# EAGLE schematic Voltage2 (EAGLE 9.1.3)
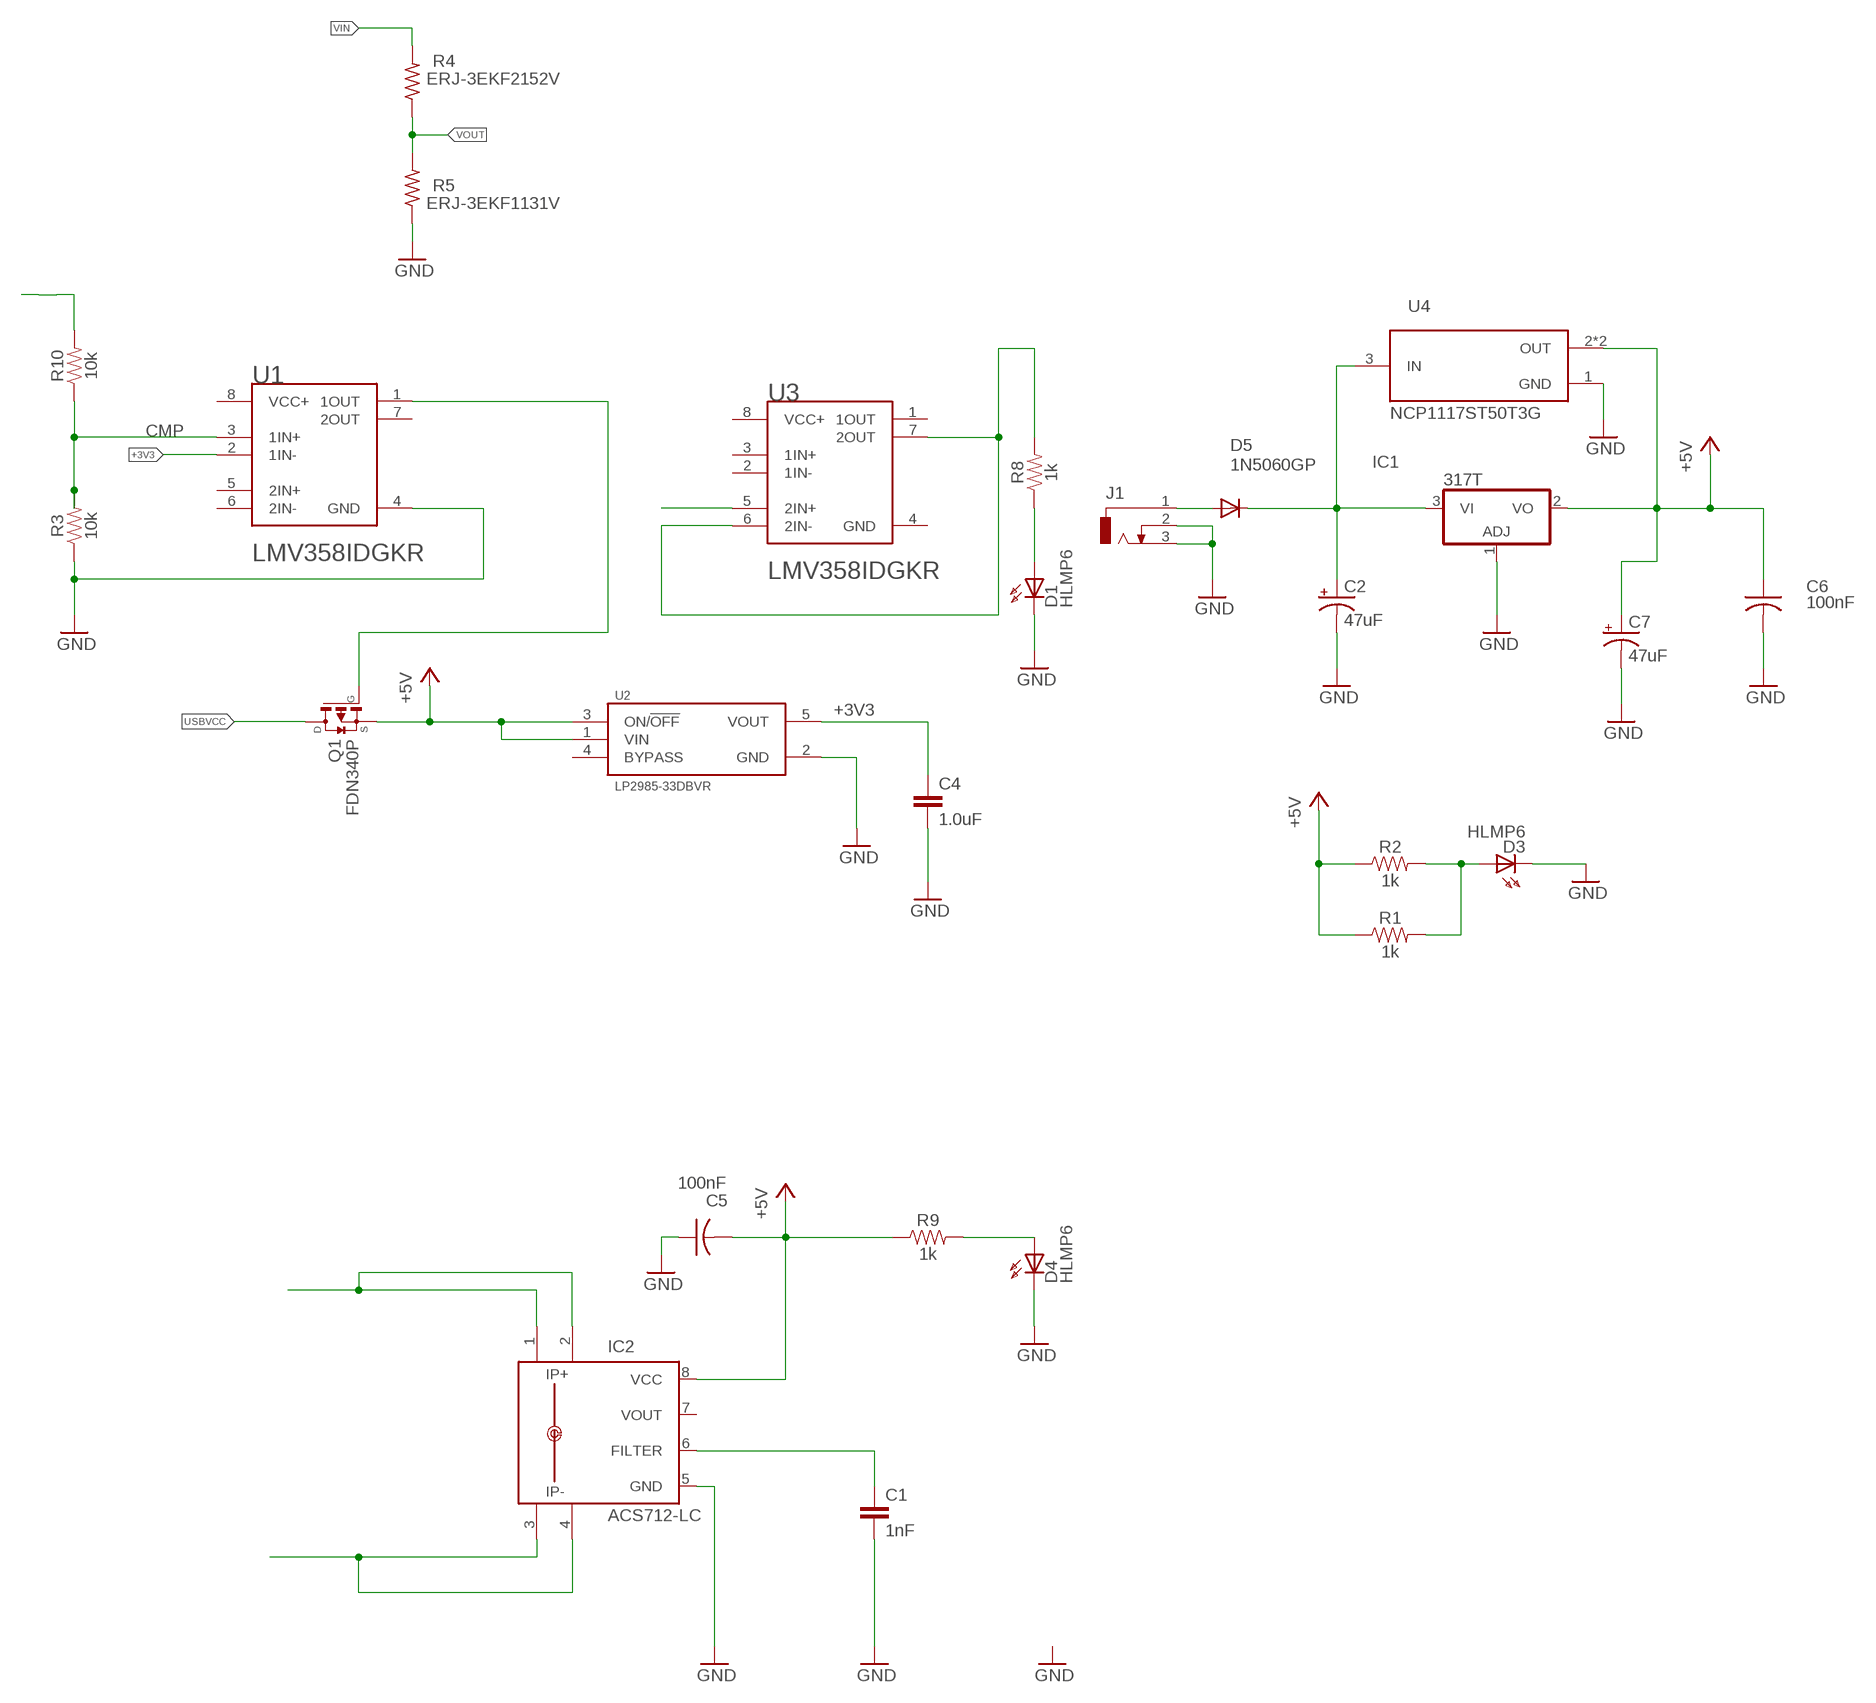
[diagram p0: schematic, sheet 1]

## Parts
C1  1nF  1.0NF/1000PF-0603-50V-10%  [0603]
C2  47uF  47UF-POLAR-EIA3528-10V-10%  [EIA3528]
C4  1.0uF  1.0UF-0603-16V-10%  [0603]
C5  100nF  C-USC0603  [C0603]
C6  100nF  C-USC0603  [C0603]
C7  47uF  47UF-POLAR-EIA3528-10V-10%  [EIA3528]
D1  HLMP6  [HLMP6]
D3  HLMP6  [HLMP6]
D4  HLMP6  [HLMP6]
D5  1N5060GP  [DO15-12]
IC1  317T  [TO220H]
IC2  ACS712-LC  [SOIC8]
J1  DCJ0303  [DCJ0303]
Q1  FDN340P  [SSOT-3]
R1  1k  1KOHM-0603-1/10W-1%  [0603]
R2  1k  1KOHM-0603-1/10W-1%  [0603]
R3  10k  10KOHM-0603-1/10W-1%  [0603]
R4  ERJ-3EKF2152V  [RESC1608X55]
R5  ERJ-3EKF1131V  [RESC1608X55]
R8  1k  1KOHM-0603-1/10W-1%  [0603]
R9  1k  1KOHM-0603-1/10W-1%  [0603]
R10  10k  10KOHM-0603-1/10W-1%  [0603]
U1  TEXAS_INSTRUMENTS_LMV358IDGKRTEXAS_INSTRUMENTS_LMV358IDGKR_0_0  [TEXAS_INSTRUMENTS_LMV358IDGKR_0]
U2  LP2985-33DBVR  [SOT95P280X145-5N]
U3  TEXAS_INSTRUMENTS_LMV358IDGKRTEXAS_INSTRUMENTS_LMV358IDGKR_0_0  [TEXAS_INSTRUMENTS_LMV358IDGKR_0]
U4  NCP1117ST50T3G  [SOT230P700X180-4N]

## Nets
1K: R8.2 U3.6(2IN-) U3.7(2OUT)
10K: R10.2
47U: C2.C(-) ; supply symbol labelled GND
100N: C6.1 C7.A(+) IC1.2(VO) U4.2(OUT) U4.4(OUT) ; supply symbol labelled +5V
+3V3: C4.1 U1.2(1IN-) U2.5(VOUT)
+5V: C5.2 IC2.8(VCC) Q1.2(S) R1.1 R2.1 R9.1 U2.1(VIN) U2.3(ON/!OFF)
CMP: R3.2 R10.1 U1.3(1IN+)
GND: C1.2 C4.2 C5.1 C6.2 C7.C(-) D1.K D3.K D4.K IC1.1(ADJ) IC2.5(GND) J1.2 J1.3 R3.1 R5.1 U1.4(GND) U2.2(GND) U4.1(GND)
N$1: D3.A R1.2 R2.2
N$2: Q1.1(G) U1.1(1OUT)
N$3: D5.A J1.1
N$6: U3.5(2IN+)
N$7: D4.A R9.2
N$9: D1.A R8.1
N$11: C2.A(+) D5.C IC1.3(VI) U4.3(IN)
N$12: C1.1 IC2.6(FILTER)
N$13: IC2.3(IP-) IC2.4(IP-1)
N$15: IC2.1(IP+) IC2.2(IP+1)
USBVCC: Q1.3(D)
VIN: R4.2
VOUT: R4.1 R5.2
Unconnected: IC2.7(VOUT) U1.5(2IN+) U1.6(2IN-) U1.7(2OUT) U1.8(VCC+) U2.4(BYPASS) U3.1(1OUT) U3.2(1IN-) U3.3(1IN+) U3.4(GND) U3.8(VCC+)

## Library data of the parts
C1 = SparkFun-Capacitors:1.0NF/1000PF: 1nF/1,000pF ceramic capacitors A capacitor is a passive two-terminal electrical component used to store electrical energy temporarily in an electric field.; PROD_ID: CAP-07886
C2 C7 = SparkFun-Capacitors:47UF-POLAR: 47µF polarized capacitors A capacitor is a passive two-terminal electrical component used to store electrical energy temporarily in an electric field.; PROD_ID: CAP-08310
C4 = SparkFun-Capacitors:1.0UF: 1µF ceramic capacitors A capacitor is a passive two-terminal electrical component used to store electrical energy temporarily in an electric field.; PROD_ID: CAP-00868
C5 C6 = resistor:C-US: CAPACITOR, American symbol
D1 D3 D4 = display-hp:HLMP6: LED 2mm horizontal; MF: AGILENT TECHNOLOGIES; MPN: HLMP-6500; OC_FARNELL: 1652490; OC_NEWARK: 40K0088
D5 = diode:1N5060GP: DIODE controlled avalanche rectifier
IC1 = linear3:*317: Positive VOLTAGE REGULATOR
IC2 = allegro-2:ACS712-LC
J1 = con-jack:DCJ0303: DC POWER JACK Source: DCJ0303.pdf; OC_FARNELL: unknown; OC_NEWARK: unknown
Q1 = FDN340P:FDN340P: P-Channel MOSFET Logic Level, PowerTrench MOSFET; AVAILABILITY: Unavailable; DESCRIPTION: FDN340P Series 20V 70 mOhm Single P-Ch Logic Level PowerTrench Mosfet SSOT-3; MF: MICROSS/On Semiconductor; MP: FDN340P; PACKAGE: SOT-23 Fairchild Semiconductor; PRICE: None
R1 R2 R8 R9 = SparkFun-Resistors:1KOHM: 1kΩ resistor A resistor is a passive two-terminal electrical component that implements electrical resistance as a circuit element. Resistors act to reduce current flow, and, at the same time, act to lower voltage levels within circuits. - Wikipedia; PROD_ID: RES-07856
R3 R10 = SparkFun-Resistors:10KOHM: 10kΩ resistor A resistor is a passive two-terminal electrical component that implements electrical resistance as a circuit element. Resistors act to reduce current flow, and, at the same time, act to lower voltage levels within circuits. - Wikipedia; PROD_ID: RES-00824
R4 = ERJ-3EKF2152V:ERJ-3EKF2152V: THICK FILM, RESISTOR, 21.5KOHM, 100mW,THICK FILM, RESISTOR, 21.5KOHM, 100mW, ±1%; DESCRIPTION: Res Thick Film 0603 21.5K Ohm 1% 1/10W ±100ppm/°C Molded SMD SMD Punched Carrier T/R; DIGI-KEY_PART_NUMBER: P21.5KHCT-ND; DIGI-KEY_PURCHASE_URL: https://www.digikey.com/product-detail/en/panasonic-electronic-components/ERJ-3EKF2152V/P21.5KHCT-ND/198247?utm_source=snapeda&utm_medium=aggregator&utm_campaign=symbol; MF: Panasonic; MP: ERJ-3EKF2152V; PACKAGE: 0603 Panasonic
R5 = ERJ-3EKF1131V:ERJ-3EKF1131V: RES SMD 1.13K OHM 1% 1/10W 0603; DESCRIPTION: Res Thick Film 0603 1.13K Ohm 1% 0.1W_1/10W_ ?100ppm/C Molded SMD Automotive Punched T/R; DIGI-KEY_PART_NUMBER: P1.13KHCT-ND; DIGI-KEY_PURCHASE_URL: https://www.digikey.com/product-detail/en/panasonic-electronic-components/ERJ-3EKF1131V/P1.13KHCT-ND/198076?utm_source=snapeda&utm_medium=aggregator&utm_campaign=symbol; MF: Panasonic; MP: ERJ-3EKF1131V; PACKAGE: 0603 Panasonic
U1 U3 = Texas Instruments - LMV358IDGKR:TEXAS_INSTRUMENTS_LMV358IDGKR: Low-Voltage Rail-to-Rail Output Operational Amplifier; CENTROID_NOT_SPECIFIED: No; DATASHEET: http://www.ti.com/lit/ds/symlink/lmv324.pdf; DIGIKEY_DESCRIPTION: IC OPAMP GP 1MHZ RRO 8VSSOP; DIGIKEY_PART_NUMBER: 296-13455-1-ND; LEAD_FREE: yes; MF: Texas Instruments; MFG_PACKAGE_IDENT: DGK (S-PDSO-G8); MOUSER_PART_NUMBER: 595-LMV358IDGKR; MPN: LMV358IDGKR; PACKAGE: VSSOP8; PREFIX: U; ROHS: yes; TEMPERATURE_RANGE_HIGH: +125°C; TEMPERATURE_RANGE_LOW: -40°C; VOLTAGE: 5.5V
U2 = LP2985-33DBVR:LP2985-33DBVR: LP2985 150-mA Low-noise Low-dropout Regulator With Shutdown; AVAILABILITY: Unavailable; DESCRIPTION: Single Output LDO, 150mA, Fixed_3.3V_, 1.5% Tolerance, Low Quiescent Current, Low Noise 5-SOT-23 -40 to 125; MF: Texas Instruments; MP: LP2985-33DBVR; PACKAGE: SOT-23-5 Texas Instruments; PRICE: None
U4 = NCP1117ST50T3G:NCP1117ST50T3G: 1.0 A Low-Dropout Positive ,Fixed and Adjustable,Voltage Regulators; AVAILABILITY: Unavailable; MF: ON Semiconductor; MP: NCP1117ST50T3G; PACKAGE: TO-261-4 HTC Korea; PRICE: None